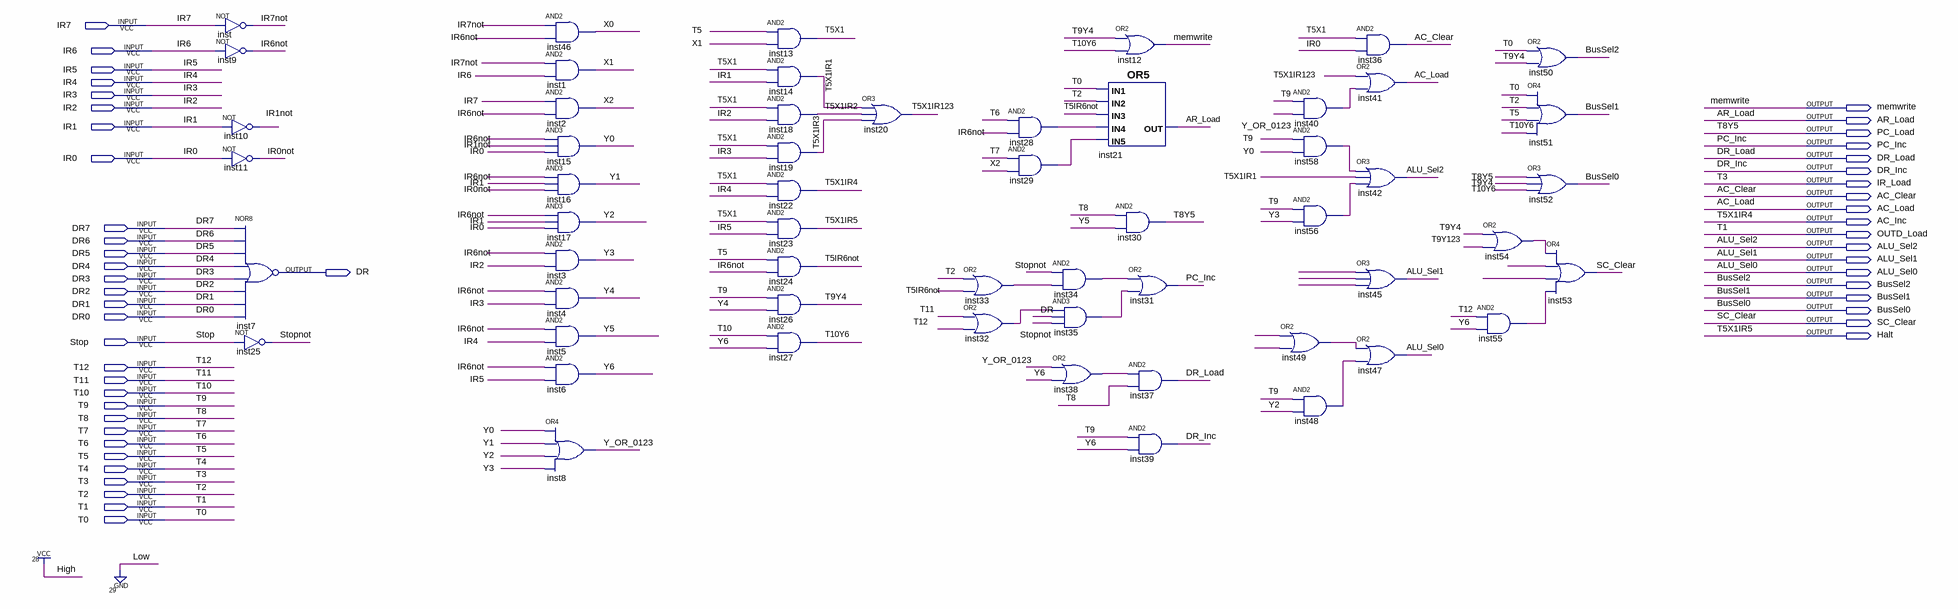
[diagram p0: schematic sheet]
// Quartus schematic lab3controller.bdf as structural Verilog: 56 symbols, 50 pins
module lab3controller (
  input  IR7,
  input  IR6,
  input  IR5,
  input  IR4,
  input  IR3,
  input  IR2,
  input  IR1,
  input  IR0,
  input  DR7,
  input  DR6,
  input  DR5,
  input  DR4,
  input  DR3,
  input  DR2,
  input  DR1,
  input  DR0,
  input  Stop,
  input  T12,
  input  T11,
  input  T10,
  input  T9,
  input  T8,
  input  T7,
  input  T6,
  input  T5,
  input  T4,
  input  T3,
  input  T2,
  input  T1,
  input  T0,
  output memwrite,
  output AR_Load,
  output PC_Load,
  output PC_Inc,
  output DR_Load,
  output DR_Inc,
  output IR_Load,
  output AC_Clear,
  output AC_Load,
  output AC_Inc,
  output OUTD_Load,
  output ALU_Sel2,
  output ALU_Sel1,
  output DR,
  output ALU_Sel0,
  output BusSel2,
  output BusSel1,
  output BusSel0,
  output SC_Clear,
  output Halt
);

  wire inst28_out, inst29_out, inst32_out, inst33_out, inst34_out, inst35_out, inst38_out, inst48_out,
       inst49_out, inst54_out, inst55_out, inst58_out, IR0not, IR1not, IR6not, IR7not, Stopnot, T5IR6not,
       T5X1, T5X1IR1, T5X1IR2, T5X1IR3, T5X1IR123, T9Y3, T9Y4, T9Y123, T10Y6, X0, X1, X2, Y0, Y1, Y2, Y3, Y4,
       Y5, Y6, Y_OR_0123;

  not inst (IR7not, IR7);
  not inst9 (IR6not, IR6);
  not inst10 (IR1not, IR1);
  not inst11 (IR0not, IR0);
  nor inst7 (DR, DR7, DR6, DR5, DR4, DR3, DR2, DR1, DR0);
  not inst25 (Stopnot, Stop);
  and inst46 (X0, IR7not, IR6not);
  and inst1 (X1, IR7not, IR6);
  and inst2 (X2, IR7, IR6not);
  and inst15 (Y0, IR6not, IR1not, IR0);
  and inst16 (Y1, IR6not, IR1, IR0not);
  and inst17 (Y2, IR6not, IR1, IR0);
  and inst3 (Y3, IR6not, IR2);
  and inst4 (Y4, IR6not, IR3);
  and inst5 (Y5, IR6not, IR4);
  and inst6 (Y6, IR6not, IR5);
  or inst8 (Y_OR_0123, Y0, Y1, Y2, Y3);
  and inst13 (T5X1, T5, X1);
  and inst14 (T5X1IR1, T5X1, IR1);
  and inst18 (T5X1IR2, T5X1, IR2);
  and inst19 (T5X1IR3, T5X1, IR3);
  and inst22 (AC_Inc, T5X1, IR4);
  and inst23 (Halt, T5X1, IR5);
  and inst24 (T5IR6not, T5, IR6not);
  and inst26 (T9Y4, T9, Y4);
  and inst27 (T10Y6, T10, Y6);
  or inst20 (T5X1IR123, T5X1IR1, T5X1IR2, T5X1IR3);
  or inst33 (inst33_out, T2, T5IR6not);
  or inst32 (inst32_out, T11, T12);
  and inst28 (inst28_out, T6, IR6not);
  and inst29 (inst29_out, T7, X2);
  and inst34 (inst34_out, Stopnot, inst33_out);
  and inst35 (inst35_out, inst32_out, DR, Stopnot);
  or inst38 (inst38_out, Y_OR_0123, Y6);
  or inst12 (memwrite, T9Y4, T10Y6);
  or inst21 (AR_Load, T0, T2, T5IR6not, inst28_out, inst29_out);
  and inst30 (PC_Load, T8, Y5);
  or inst31 (PC_Inc, inst34_out, inst35_out);
  and inst37 (DR_Load, inst38_out, T8);
  and inst39 (DR_Inc, T9, Y6);
  and inst40 (T9Y123, T9, Y_OR_0123);
  and inst58 (inst58_out, T9, Y0);
  and inst56 (T9Y3, T9, Y3);
  or inst49 (inst49_out, T5X1IR1, T5X1IR3);
  and inst48 (inst48_out, T9, Y2);
  and inst36 (AC_Clear, T5X1, IR0);
  or inst41 (AC_Load, T5X1IR123, T9Y123);
  or inst42 (ALU_Sel2, inst58_out, T5X1IR1, T9Y3);
  or inst45 (ALU_Sel1, T9Y3, T5X1IR123, T10Y6);
  or inst47 (ALU_Sel0, inst49_out, inst48_out);
  or inst54 (inst54_out, T9Y4, T9Y123);
  and inst55 (inst55_out, T12, Y6);
  or inst50 (BusSel2, T0, T9Y4);
  or inst51 (BusSel1, T0, T2, T5, T10Y6);
  or inst52 (BusSel0, PC_Load, T9Y4, T10Y6);
  or inst53 (SC_Clear, inst54_out, T5X1, PC_Load, inst55_out);

  assign IR_Load = T3;
  assign OUTD_Load = T1;

  // Other names for the same wires on the sheet: T5X1IR4 = AC_Inc; T5X1IR5 = Halt; T8Y5 = PC_Load
endmodule
